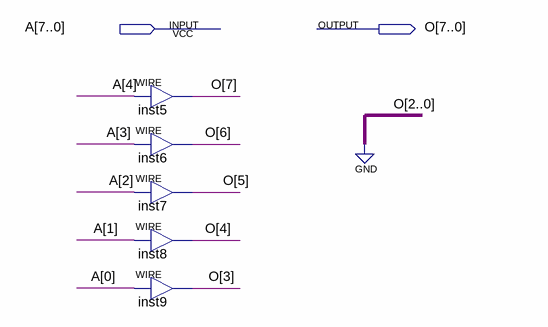
[diagram p0: schematic sheet]
// Quartus schematic g27_8bit_shift_3left.bdf as structural Verilog: 5 symbols, 2 pins
module g27_8bit_shift_3left (
  input  [7:0] A,
  output [7:0] O
);

  assign O[7] = A[4];  // WIRE inst5
  assign O[6] = A[3];  // WIRE inst6
  assign O[5] = A[2];  // WIRE inst7
  assign O[4] = A[1];  // WIRE inst8
  assign O[3] = A[0];  // WIRE inst9

  assign O[2:0] = 3'b000;
endmodule
